# EAGLE design MainBoard (EAGLE 9.6.2)
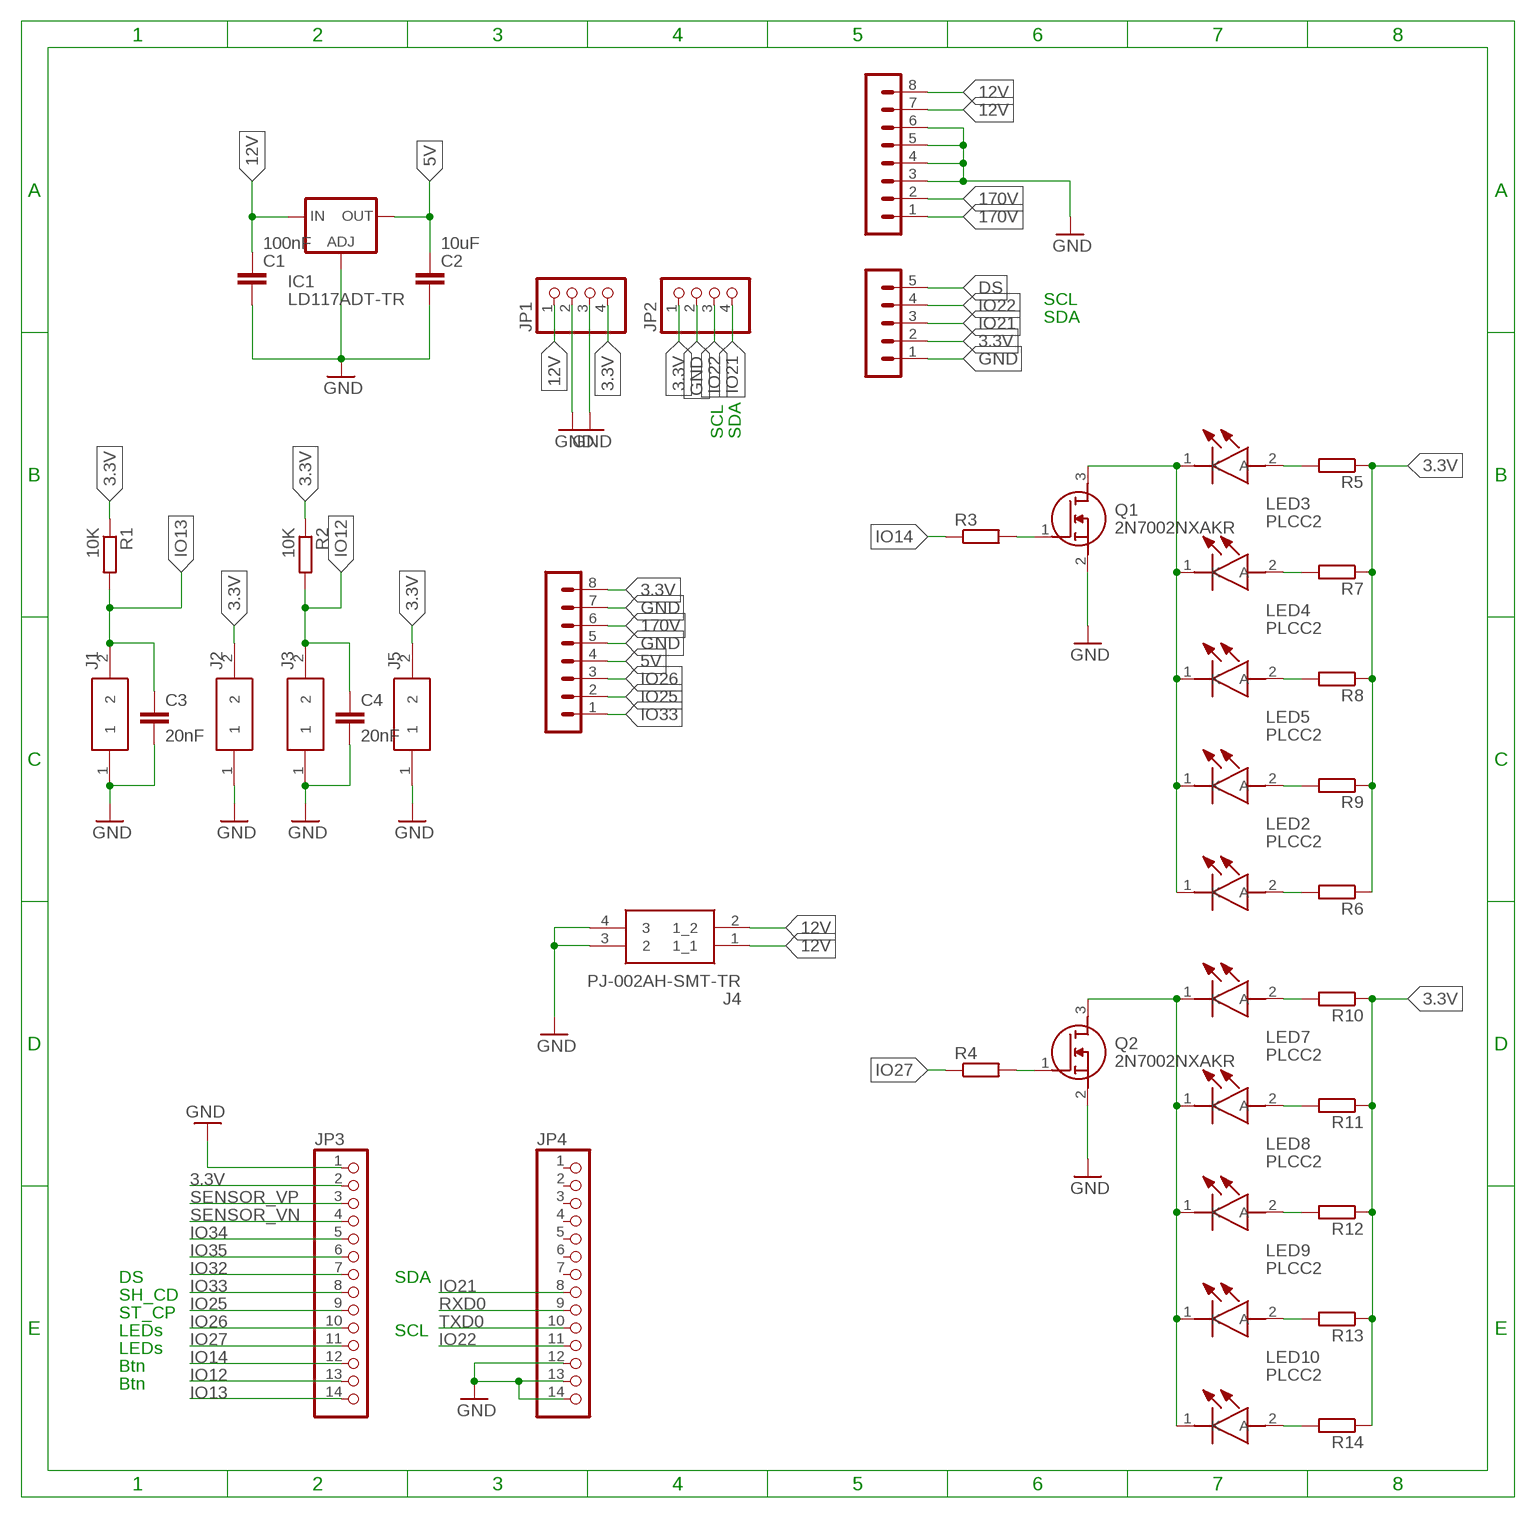
[diagram p0: schematic, sheet 1]

## Parts
C1  100nF  C-EU_1206C1206  [C1206]
C2  10uF  C-EU_1206C1206  [C1206]
C3  20nF  C-EU_805C0805  [C0805]
C4  20nF  C-EU_805C0805  [C0805]
IC1  LD117ADT-TR  [DPACK]
J1  S2B-NSHSS-TB  [SM02B-NSHSS-TB]
J2  S2B-NSHSS-TB  [SM02B-NSHSS-TB]
J3  S2B-NSHSS-TB  [SM02B-NSHSS-TB]
J4  PJ-002AH-SMT-TR  [PJ-002AH-SMT-TR]
J5  S2B-NSHSS-TB  [SM02B-NSHSS-TB]
JP1  PINHD-1X4  [1X04]
JP2  PINHD-1X4  [1X04]
JP3  PINHD-1X14  [1X14]
JP4  PINHD-1X14  [1X14]
LED1  PLCC2  [LEDM3528X200N]
LED2  PLCC2  [LEDM3528X200N]
LED3  PLCC2  [LEDM3528X200N]
LED4  PLCC2  [LEDM3528X200N]
LED5  PLCC2  [LEDM3528X200N]
LED6  PLCC2  [LEDM3528X200N]
LED7  PLCC2  [LEDM3528X200N]
LED8  PLCC2  [LEDM3528X200N]
LED9  PLCC2  [LEDM3528X200N]
LED10  PLCC2  [LEDM3528X200N]
Q1  2N7002NXAKR  [SOT95P230X110-3N]
Q2  2N7002NXAKR  [SOT95P230X110-3N]
R1  10K  R-EU_1206R1206  [R1206]
R2  10K  R-EU_1206R1206  [R1206]
R3  R-EU_1206R1206  [R1206]
R4  R-EU_1206R1206  [R1206]
R5  R-EU_1206R1206  [R1206]
R6  R-EU_1206R1206  [R1206]
R7  R-EU_1206R1206  [R1206]
R8  R-EU_1206R1206  [R1206]
R9  R-EU_1206R1206  [R1206]
R10  R-EU_1206R1206  [R1206]
R11  R-EU_1206R1206  [R1206]
R12  R-EU_1206R1206  [R1206]
R13  R-EU_1206R1206  [R1206]
R14  R-EU_1206R1206  [R1206]
SV1  PINHEADER-1X8  [MA08-1]
SV6  MA05-1  [MA05-1]
SV7  PINHEADER-1X8  [MA08-1]

## Nets
3.3V: J2.2 J5.2 JP1.4 JP2.1 JP3.2 R1.1 R2.1 R5.1 R6.1 R7.1 R8.1 R9.1 R10.1 R11.1 R12.1 R13.1 R14.1 SV1.8 SV6.2
5V: C2.1 IC1.4(OUT) SV1.4
12V: C1.1 IC1.3(IN) J4.1(1_1) J4.2(1_2) JP1.1 SV7.7 SV7.8
170V: SV1.6 SV7.1 SV7.2
DS: SV6.5
GND: C1.2 C2.2 C3.2 C4.2 IC1.1(ADJ) J1.1 J2.1 J3.1 J4.3 J4.4 J5.1 JP1.2 JP1.3 JP2.2 JP3.1 JP4.12 JP4.13 JP4.14 Q1.2(S) Q2.2(S) SV1.5 SV1.7 SV6.1 SV7.3 SV7.4 SV7.5 SV7.6
GND_LED_BTM: LED6.1(K) LED7.1(K) LED8.1(K) LED9.1(K) LED10.1(K) Q2.3(D)
GND_LED_TOP: LED1.1(K) LED2.1(K) LED3.1(K) LED4.1(K) LED5.1(K) Q1.3(D)
IO12: C4.1 J3.2 JP3.13 R2.2
IO13: C3.1 J1.2 JP3.14 R1.2
IO14: JP3.12 R3.1
IO21: JP2.4 JP4.8 SV6.3
IO22: JP2.3 JP4.11 SV6.4
IO25: JP3.9 SV1.2
IO26: JP3.10 SV1.3
IO27: JP3.11 R4.1
IO32: JP3.7
IO33: JP3.8 SV1.1
IO34: JP3.5
IO35: JP3.6
N$2: Q1.1(G) R3.2
N$3: LED1.2(A) R5.2
N$4: LED3.2(A) R7.2
N$5: LED4.2(A) R8.2
N$6: LED5.2(A) R9.2
N$7: LED2.2(A) R6.2
N$8: Q2.1(G) R4.2
N$10: LED6.2(A) R10.2
N$11: LED7.2(A) R11.2
N$12: LED8.2(A) R12.2
N$13: LED9.2(A) R13.2
N$14: LED10.2(A) R14.2
RXD0 [other]: JP4.9
SENSOR_VN: JP3.4
SENSOR_VP: JP3.3
TXD0 [other]: JP4.10
Unconnected: JP4.1 JP4.2 JP4.3 JP4.4 JP4.5 JP4.6 JP4.7

## Notes on the sheet
- SCL
- SDA
- SCL | SDA
- DS | SDA
- SH_CD
- ST_CP
- LEDs | SCL
- LEDs
- Btn
- Btn

## Library data of the parts
C1 C2 = CommonParts:C-EU_1206: CAPACITOR, European symbol; SPICEPREFIX: C
C3 C4 = CommonParts:C-EU_805: CAPACITOR, European symbol; SPICEPREFIX: C
IC1 = nixie_tube:LD117A?*: Low drop fixed and adjustable positive voltage regulators 1 A Source: http://www.st.com/stonline/products/literature/ds/7194/ld1117axx.pdf
J1-J3 J5 = CommonParts:S2B-NSHSS-TB: NSH 1.0mm SMT shrouded R/A PCB header,2P JST NSH Series, 1mm Pitch 2 Way 1 Row Shrouded Right Angle PCB Header, Surface Mount, Solder Termination Source: Datasheet <http://www.jst-mfg.com/product/pdf/eng/eNSH.pdf>; DESCRIPTION: NSH 1.0mm SMT shrouded R/A PCB header,2P JST NSH Series, 1mm Pitch 2 Way 1 Row Shrouded Right Angle PCB Header, Surface Mount, Solder Termination; HEIGHT: mm; MANUFACTURER_NAME: JST (JAPAN SOLDERLESS TERMINALS); MANUFACTURER_PART_NUMBER: SM02B-NSHSS-TB(LF)(SN)
J4 = CommonParts:PJ-002AH-SMT-TR: DC Power Connectors Power Jacks Source: Datasheet <https://componentsearchengine.com/Datasheets/1/PJ-002AH-SMT-TR.pdf>; DESCRIPTION: DC Power Connectors Power Jacks; HEIGHT: mm; MANUFACTURER_NAME: CUI; MANUFACTURER_PART_NUMBER: PJ-002AH-SMT-TR; MOUSER_PART_NUMBER: 490-PJ-002AH-SMT-TR; MOUSER_PRICE-STOCK: https://www.mouser.com/Search/Refine.aspx?Keyword=490-PJ-002AH-SMT-TR
JP1 JP2 = pinhead:PINHD-1X4: PIN HEADER
JP3 JP4 = pinhead:PINHD-1X14: PIN HEADER
LED1-LED10 = CommonParts:PLCC2: Cool White SMT LED, PLCC2 1800mcd Min. Broadcom ASMT-UWB1-NX302, ASMT-UWB Series White LED, 6250K, PLCC 2, Round Lens SMD package Source: Datasheet <https://componentsearchengine.com/Datasheets/1/ASMT-UWB1-NX302.pdf>; DESCRIPTION: Cool White SMT LED, PLCC2 1800mcd Min. Broadcom ASMT-UWB1-NX302, ASMT-UWB Series White LED, 6250K, PLCC 2, Round Lens SMD package; HEIGHT: 2mm; MANUFACTURER_NAME: Avago Technologies; MANUFACTURER_PART_NUMBER: ASMT-UWB1-NX302; MOUSER2_PART_NUMBER: 630-ASMT-UWB1-NX302; MOUSER2_PRICE-STOCK: https://www.mouser.com/Search/Refine.aspx?Keyword=630-ASMT-UWB1-NX302
Q1 Q2 = CommonParts:2N7002NXAKR: NEXPERIA - 2N7002NXAKR - MOSFET Transistor, Trench, N Channel, 190 mA, 60 V, 3 ohm, 10 V, 1.6 V Source: Datasheet <https://componentsearchengine.com/Datasheets/1/2N7002NXAKR.pdf>; DESCRIPTION: NEXPERIA - 2N7002NXAKR - MOSFET Transistor, Trench, N Channel, 190 mA, 60 V, 3 ohm, 10 V, 1.6 V; HEIGHT: 1.1mm; MANUFACTURER_NAME: Nexperia; MANUFACTURER_PART_NUMBER: 2N7002NXAKR; MOUSER_PART_NUMBER: 771-2N7002NXAKR; MOUSER_PRICE-STOCK: https://www.mouser.com/Search/Refine.aspx?Keyword=771-2N7002NXAKR
R1-R14 = CommonParts:R-EU_1206: RESISTOR, European symbol
SV1 SV7 = CommonParts:PINHEADER-1X8: PIN HEADER; OC_FARNELL: unknown; OC_NEWARK: unknown
SV6 = con-lstb:MA05-1: PIN HEADER; OC_FARNELL: unknown; OC_NEWARK: unknown

## Net classes
0 default: width 0.2 mm, drill 0.6 mm, clearance 0.2 mm
1 other: width 0.2 mm, drill 0.2 mm, clearance 0.1 mm

## Board
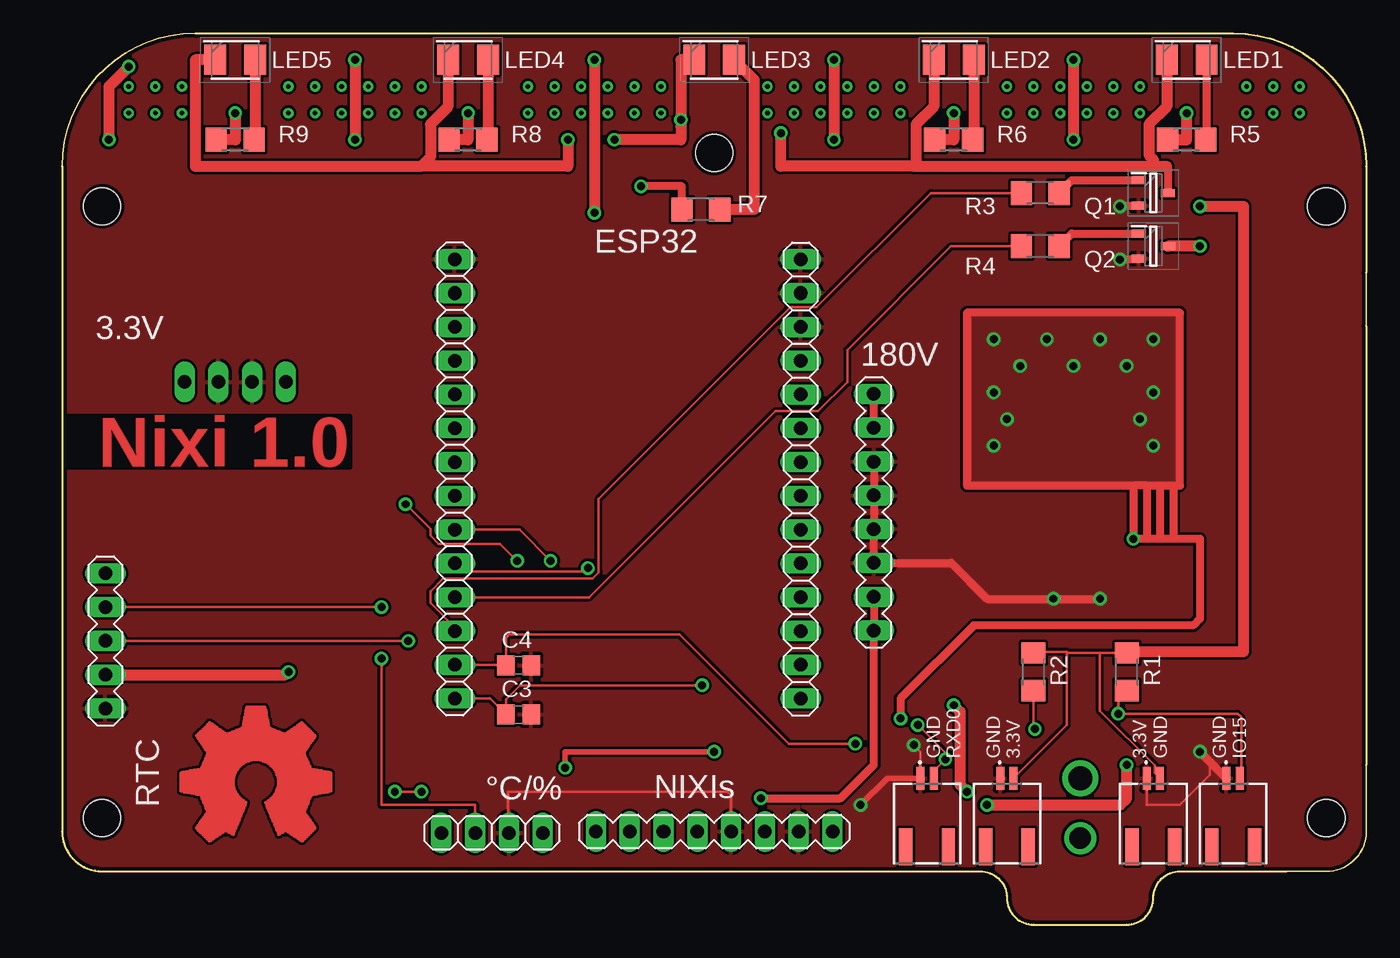
[diagram p1: board, top side]
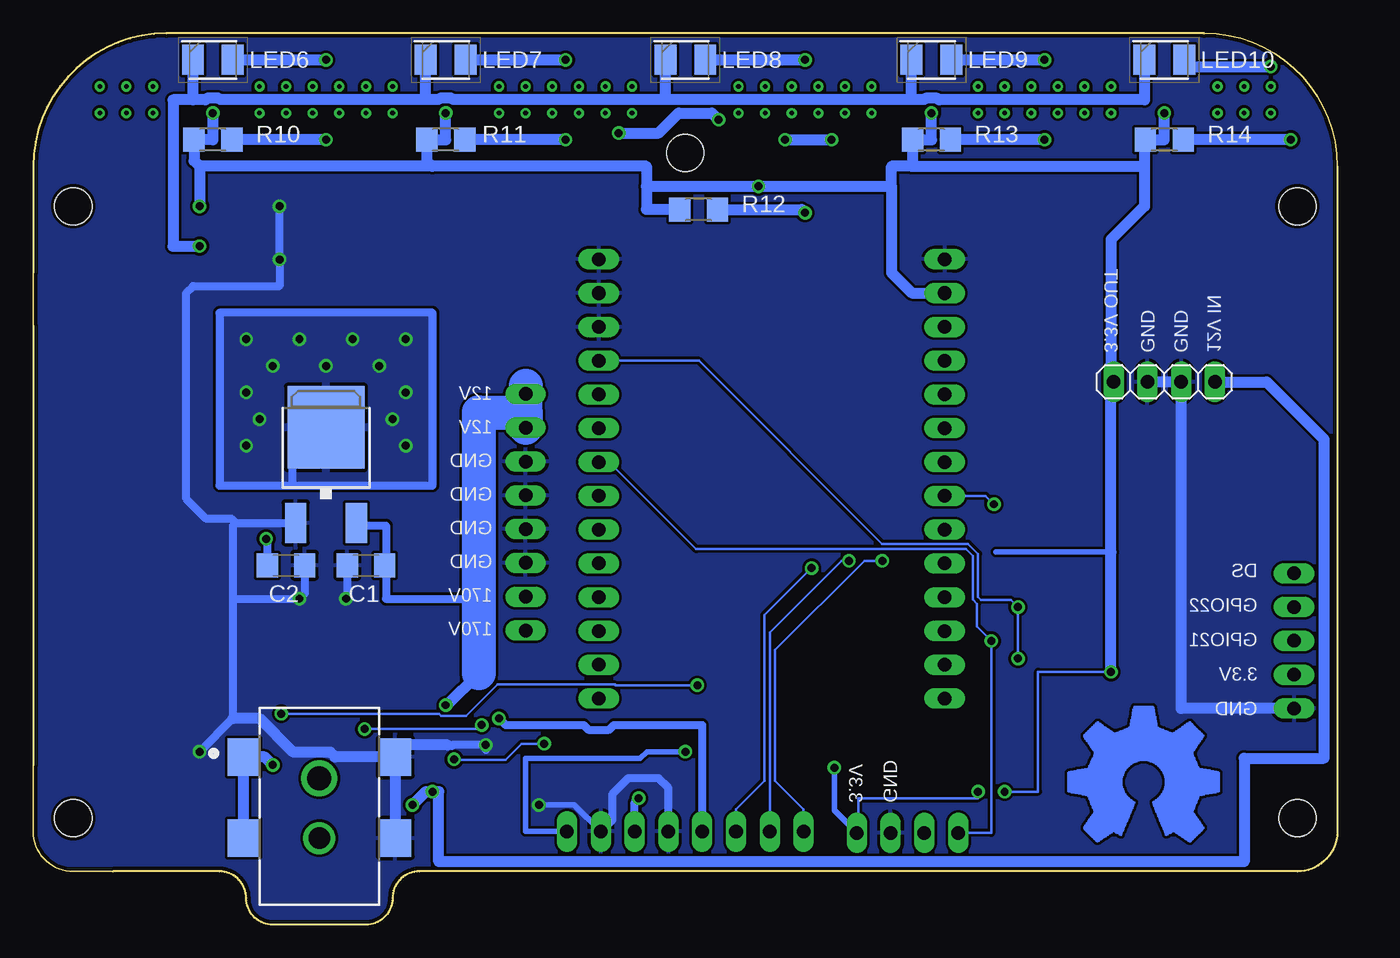
[diagram p2: board, bottom side, seen from below]

Size 98 x 67 mm. Coordinates in mm from the lower left corner, seen from the top.
Outline: 98,45 98,49 98,57 arc90 88,67 10,67 arc90 0,57 0,7 arc90 3,4 69,4 arc-90 71,2 arc90 73,0 80,0 arc90 82,2 arc-90 84,4 92,4 95,4 arc90 98,7 98,45
Outline: 98,45 98,12
Copper layers (1*16): Top 0.035mm / dielectric 1.5mm / Bottom 0.035mm
Design rules "Main_1 *": minimum track width 6mil, minimum drill 0.35mm, track to track 6mil, track to pad 6mil, pad to pad 6mil, via to via 6mil, smd to smd 6mil, copper to edge 10mil, drill to drill 6mil, minimum pad ring 10mil, minimum via ring 8mil, stop-mask expansion 4mil, vias tented up to drill 0mil, thermal gap 10mil
Holes 2.8 mm at 3,54 95,54 3,8 95,8 49,58

### Footprints (pad centres in the part's own frame; a part is rotated, then mirrored left to right if it is on the bottom)
C1206 = smd 1.6 x 1.8: 1 -1.4,0; 2 1.4,0
C0805 = smd 1.3 x 1.5: 1 -0.95,0; 2 0.95,0
DPACK = smd 1.6 x 3: 1 -2.28,-4.8; 3 2.28,-4.8 | smd 5.8 x 6.2: 4 0,2.38
SM02B-NSHSS-TB = smd 0.6 x 1.7: 1 1,0; 2 0,0 | smd 1 x 2.8: 3 -1.1,5.15; 4 2.1,5.15
PJ-002AH-SMT-TR = smd 2.8 x 2.4: 1 11.1,10.2; 2 5,10.2; 3 5,-1.2; 4 11.1,-1.2 | drill 1.8 pad 2.7: 5 9.5,4.5 | drill 1.6 pad 2.4: 6 5,4.5
1X04 = drill 1.016 long: 1 -3.81,0; 2 -1.27,0; 3 1.27,0; 4 3.81,0
1X14 = drill 1.016 long: 1 -16.51,0; 2 -13.97,0; 3 -11.43,0; 4 -8.89,0; 5 -6.35,0; 6 -3.81,0; 7 -1.27,0; 8 1.27,0; 9 3.81,0; 10 6.35,0; 11 8.89,0; 12 11.43,0; 13 13.97,0; 14 16.51,0
LEDM3528X200N = smd 1.65 x 2.25: 1 -1.5,0; 2 1.5,0
SOT95P230X110-3N = smd 1.05 x 0.6: 1 -1.1,0.95; 2 -1.1,-0.95; 3 1.1,0
R1206 = smd 1.6 x 1.803: 1 -1.422,0; 2 1.422,0
MA08-1 = drill 1.016 long: 1 -8.89,0; 2 -6.35,0; 3 -3.81,0; 4 -1.27,0; 5 1.27,0; 6 3.81,0; 7 6.35,0; 8 8.89,0
MA05-1 = drill 1.016 long: 1 -5.08,0; 2 -2.54,0; 3 0,0; 4 2.54,0; 5 5.08,0

### Placement (x,y rotation side)
C1  73,27 180 bottom
C2  79,27 0 bottom
C3  34.3,15.8 0 top
C4  34.3,19.5 0 top
IC1  76,35 0 bottom
J1  88.5,11 180 top
J2  71.5,11 180 top
J3  65.5,11 180 top
J4  72,1.5 90 bottom
J5  82.5,11 180 top
JP1  13,40.8 180 bottom
JP2  32.3,6.9 180 top
JP3  29.5,33.5 270 top
JP4  55.5,33.5 90 top
LED1  84.5,65 0 top
LED2  67,65 0 top
LED3  49,65 0 top
LED4  30.5,65 0 top
LED5  13,65 0 top
LED6  84.5,65 0 bottom
LED7  67,65 0 bottom
LED8  49,65 0 bottom
LED9  30.5,65 0 bottom
LED10  13,65 0 bottom
Q1  82,55 0 top
Q2  82,51 0 top
R1  80,19 270 top
R2  73,19 270 top
R3  73.5,55 0 top
R4  73.5,51 0 top
R5  84.5,59 0 top
R6  67,59 0 top
R7  48,53.75 0 top
R8  30.5,59 0 top
R9  13,59 0 top
R10  84.5,59 0 bottom
R11  67,59 0 bottom
R12  48,53.75 0 bottom
R13  30.5,59 0 bottom
R14  13,59 0 bottom
SV1  49,7 0 top
SV6  3.25,21.33 90 top
SV7  61,31 90 top

### Tracks (layer width: path | path; a pad name or v marks a point on that pad's centre or on a via)
3.3V  (via drill 0.6)
  Top 0.2: J2.2 75.5,15 75.5,20.5 | 75.5,20.5 73.08,20.5 R2.1 | R1.1 78,20.42 | 78,20.42 75.58,20.42 75.5,20.5 | J5.2 82.1,11.4 82.1,11.97 78,16.07 78,20.42 | v27,10 v25,10
  Top 0.406: v49,13 37.8,13 v37.8,11.8
  Top 0.61: R7.1 46.58,55.5 v43.5,55.5
  Top 0.813: v67,61 67,59 R6.1 | v30.5,61 30.5,59 R8.1 | v13,61 13,59 R9.1 | R5.1 84.5,59 v84.5,61 | v85.5,54 88.78,54 88.78,20.5 80.08,20.5 R1.1 | SV6.2 16.79,18.79 v17,19
  Bottom 0.2: v17,19 22.5,19 22.5,10 v25,10 | JP2.1 36,7.01 36,9.5 27,9.5 v27,10
  Bottom 0.406: v49,13 51.89,13 52.38,12.51 61,12.51 61,7 SV1.8 | 25.67,28 17,28 | v37.8,11.8 37.8,8.59 JP2.1
  Bottom 0.813: v67,61 67,59 R11.1 68.42,57.42 68,57 | v30.5,61 30.48,61 30.48,59 R13.1 31.92,57.08 32,57 | v13,61 13,59 R14.1 14.5,58.92 14.5,57 | v84.5,61 84.5,59 R10.1 85.92,57.42 85.5,57 | JP1.4 17,40.99 | 17,40.99 17,51.5 14.5,54 14.5,57 | 32,57 14.5,57 | 32,57 33.5,57 33.5,55.5 | 68,57 51.92,57 51.92,55.5 | 68,57 85.5,57 | 85.5,57 v85.5,54 | R12.1 51.92,53.75 51.92,55.5 | v17,19 17,28 17,40.99 | 51.92,55.5 v43.5,55.5 33.5,55.5 | JP3.2 31.97,47.47 33.5,49 33.5,55.5
5V  (via drill 0.6)
  Top 0.61: 83.5,29 85.5,29 85.5,23 85,22.5 68.5,22.5 63,17 v63,15.5 | 83.5,29 82.5,29 | 82.5,29 81.5,29 | 81.5,33 81.5,29 | 81.5,33 80.5,33 | 80.5,33 v80.5,29 81.5,29 | 80.5,33 68,33 68,46 84,46 84,33 83.5,33 | 81.5,33 82.5,33 | 82.5,33 83.5,33 | 83.5,33 83.5,29 | 82.5,33 82.5,29
  Bottom 0.61: 78.5,33 84,33 84,46 68,46 68,33 78.5,33 | C2.1 80.4,28.9 v80.5,29 | v63,15.5 62.5,15 56.63,15 56.29,14.65 54.71,14.65 54.37,15 47.73,15 SV1.4 | 78.5,33 78.5,36 77.12,37.38 IC1.4
  other vias: 82,36 81,38 82,40 80,42 82,44 78,44 76,42 74,44 72,42 70,44 70,40 71,38 70,36
  pour Bottom: 68,33 84,33 84,46 68,46
  pour Top: 68,46 84,46 84,33 68,33
12V  (via drill 0.6)
  Top 0.61: SV7.7 SV7.8
  Top 0.813: v68,10 67.5,10.5 67.5,16 v67,16.5 | v69.5,9 79.5,9 80,9.5 v80,12
  Bottom 0.61: C1.1 71.5,26.9 | 71.5,26.9 71.5,24.5 65,24.5 64.5,25 | IC1.3 73.52,30 71.5,30 71.5,26.9
  Bottom 0.813: JP1.1 5.3,40.8 1,36.5 1,12.5 7,12.5 7,4.74 67.54,4.74 67.54,10 v68,10 68.5,10 v69.5,9 | v67,16.5 66.9,16.5 64.5,18.9 | v80,12 80.6,12.6 J4.1 J4.2
  Bottom 2.54: 64.5,18.9 64.5,25 64.5,38.5 61,38.5 | 61,40.5 SV7.8 61,38.5 | 61,38.5 SV7.7
170V  (via drill 0.6)
  Top 0.61: v52.5,9.5 58.5,9.5 61,12 SV7.1 SV7.2
  Bottom 0.61: SV1.6 52.81,9.19 v52.5,9.5
GND  (via drill 0.6)
  Top 0.2: J3.1 64.5,13 v64,13.5 | SV1.5 50.27,9.73 50,10 33.5,10 33.5,6.97 JP2.2
  Top 0.203: J5.1 81.5,9 84,9 86.25,11.25 86.25,12.25
  Top 0.406: v60,9 62,11 J3.1
  Top 0.61: J1.1 86.25,12.25 v85.5,13 | SV7.6 SV7.5 SV7.4 SV7.3 66.81,27.19 69.5,24.5 v74.5,24.5 v78,24.5 | v79.5,54 79.55,54.05 Q1.2 | Q2.2 80.85,50 v79.5,50
  Bottom 0.2: 66.5,13.5 66.88,13.5 66.94,13.44
  Bottom 0.406: SV1.7 57.35,9 v60,9
  Bottom 0.61: 64,13.11 v64,13.5 66.5,13.5 66.56,13.44 66.94,13.44 | SV1.5 50.27,10.27 51,11 53.29,11 54.5,9.79 54.5,7.85 SV1.7 | C2.2 77.6,24.9 v78,24.5 83,24.5 | C1.2 74.4,24.6 v74.5,24.5 | 82.8,30.2 IC1.1 | 82.8,30.2 83,30 83,24.5 | 83,24.5 83,15.5 v85.5,13 | 82.8,30.2 83.1,30.5 85,30.5 86.5,32 86.5,47.5 86,48 79.5,48 v79.5,50 v79.5,54
  Bottom 0.813: JP1.3 JP1.2 11.73,16.25 SV6.1 | 66.88,13.5 69.9,13.5 J4.4 | J4.4 J4.3 | J4.4 75.33,12.6 75.69,12.96 78.46,12.96 81,15.5 83,15.5
  pour Top: 0,0 0,57 arc-90 10,67 88,67 arc-90 98,57 98,0
  pour Bottom: 98,0.5 2.5,0.5 arc-90 -0.5,3.5 -0.5,56.5 arc-90 10,67 88,67 arc-90 98,57
GND1  (via drill 0.35)
  other vias: 17,63
GND2  (via drill 0.35)
  other vias: 19,63
GND3  (via drill 0.35)
  other vias: 17,61
GND4  (via drill 0.35)
  other vias: 19,61
GND5  (via drill 0.35)
  other vias: 21,63
GND6  (via drill 0.35)
  other vias: 23,63
GND7  (via drill 0.35)
  other vias: 21,61
GND8  (via drill 0.35)
  other vias: 23,61
GND9  (via drill 0.35)
  other vias: 25,63
GND10  (via drill 0.35)
  other vias: 27,63
GND11  (via drill 0.35)
  other vias: 25,61
GND12  (via drill 0.35)
  other vias: 27,61
GND13  (via drill 0.35)
  other vias: 35,63
GND14  (via drill 0.35)
  other vias: 37,63
GND15  (via drill 0.35)
  other vias: 35,61
GND16  (via drill 0.35)
  other vias: 37,61
GND17  (via drill 0.35)
  other vias: 39,63
GND18  (via drill 0.35)
  other vias: 41,63
GND19  (via drill 0.35)
  other vias: 39,61
GND20  (via drill 0.35)
  other vias: 41,61
GND21  (via drill 0.35)
  other vias: 43,63
GND22  (via drill 0.35)
  other vias: 45,63
GND23  (via drill 0.35)
  other vias: 43,61
GND24  (via drill 0.35)
  other vias: 45,61
GND25  (via drill 0.35)
  other vias: 53,63
GND26  (via drill 0.35)
  other vias: 55,63
GND27  (via drill 0.35)
  other vias: 53,61
GND28  (via drill 0.35)
  other vias: 55,61
GND29  (via drill 0.35)
  other vias: 57,63
GND30  (via drill 0.35)
  other vias: 59,63
GND31  (via drill 0.35)
  other vias: 57,61
GND32  (via drill 0.35)
  other vias: 59,61
GND33  (via drill 0.35)
  other vias: 61,63
GND34  (via drill 0.35)
  other vias: 63,63
GND35  (via drill 0.35)
  other vias: 61,61
GND36  (via drill 0.35)
  other vias: 63,61
GND37  (via drill 0.35)
  other vias: 71,63
GND38  (via drill 0.35)
  other vias: 73,63
GND39  (via drill 0.35)
  other vias: 71,61
GND40  (via drill 0.35)
  other vias: 73,61
GND41  (via drill 0.35)
  other vias: 75,63
GND42  (via drill 0.35)
  other vias: 77,63
GND43  (via drill 0.35)
  other vias: 75,61
GND44  (via drill 0.35)
  other vias: 77,61
GND45  (via drill 0.35)
  other vias: 79,63
GND46  (via drill 0.35)
  other vias: 81,63
GND47  (via drill 0.35)
  other vias: 79,61
GND48  (via drill 0.35)
  other vias: 81,61
GND49  (via drill 0.35)
  other vias: 5,63
GND50  (via drill 0.35)
  other vias: 7,63
GND51  (via drill 0.35)
  other vias: 9,63
GND52  (via drill 0.35)
  other vias: 5,61
GND53  (via drill 0.35)
  other vias: 7,61
GND54  (via drill 0.35)
  other vias: 9,61
GND55  (via drill 0.35)
  other vias: 89,63
GND56  (via drill 0.35)
  other vias: 91,63
GND57  (via drill 0.35)
  other vias: 93,63
GND58  (via drill 0.35)
  other vias: 89,61
GND59  (via drill 0.35)
  other vias: 91,61
GND60  (via drill 0.35)
  other vias: 93,61
GND_LED_BTM  (via drill 0.6)
  Top 0.813: v85.5,51 Q2.3
  Bottom 0.813: LED10.1 14.5,62 29.93,62 30.04,62.11 30.96,62.11 31.05,62.02 32,62.02 | 32,62.02 50.5,62.02 | 86,62 85.07,62 84.96,62.11 84.04,62.11 83.95,62.02 68.5,62.02 | 86,62 87.5,62 87.5,51 v85.5,51 | 50.5,62.02 66.45,62.02 66.54,62.11 67.46,62.11 67.55,62.02 68.5,62.02 | 32,62.02 LED9.1 | 50.5,62.02 LED8.1 | 68.5,62.02 LED7.1 | 86,62 LED6.1
GND_LED_TOP  (via drill 0.6)
  Top 0.61: 83,57 83.1,56.9 Q1.3
  Top 0.813: LED5.1 10,65 10,57 27,57 | 64,57 82,57 | 82,57 83,57 | LED2.1 65.5,61.48 64.17,60.15 64.17,57.17 64,57 | LED3.1 46.52,65 46.5,64.98 v46.5,60.5 46.5,60 46.5,59 v41.5,59 | LED1.1 83,61.48 81.67,60.15 81.67,57.85 82,57.52 82,57 | LED4.1 29,61.48 27.67,60.15 27.67,57.67 27,57 | v38,59 38,57 27,57 | 64,57 54,57 v54,59.5
  Bottom 0.813: v41.5,59 v38,59 | v54,59.5 51,59.5 49.5,61 47,61 v46.5,60.5
IO12  (via drill 0.6)
  Top 0.2: v66.38,12.43 66.38,12.92 v64.3,15 | v73.1,14.7 73,14.8 R2.2
  Top 0.203: JP3.13 33.32,19.53 C4.1 33.35,21.55 33.6,21.8 46.4,21.8 54.6,13.6 v59.6,13.6 | v66.38,12.43 65.5,11.55 J3.2
  Bottom 0.2: v64.3,15 64.6,14.7 v73.1,14.7
  Bottom 0.203: v59.6,13.6 61.3,13.6 62.5,12.4 66.35,12.4 v66.38,12.43
IO13  (via drill 0.6)
  Top 0.2: v79.36,15.86 88.34,15.86 88.6,15.6 88.6,11.1 J1.2
  Top 0.203: JP3.14 32.16,16.99 C3.1 33.35,16.95 34.4,18 v48.1,18 | v79.36,15.86 79.36,16.93 R1.2
  Bottom 0.203: v48.1,18 54.24,18 54.3,18.05 63.12,18.05 65.48,15.7 67.33,15.7 67.49,15.86 v79.36,15.86
IO14
  Top 0.2: R3.1 65.29,55 56.7,46.41 54.71,46.41 40.31,32 40.31,26.47 39.84,26 28.63,26 27.68,25.05 27.68,24.17 29.5,22.35 JP3.12
IO21  (via drill 0.6)
  Top 0.2: SV6.3 v26,21.33
  Bottom 0.2: 26,21.5 v26,21.33 26,6.9 JP2.4
  Bottom 0.203: v26,21.33 27.08,22.41 27.08,24.12 27.4,24.45 27.4,27.7 27.93,28.22 48.19,28.22 54.74,34.77 JP4.8
IO22  (via drill 0.6)
  Top 0.2: SV6.4 v24,23.87 | v24,20 24,9 31.03,9 JP2.3
  Bottom 0.2: 24,24 v24,23.87 v24,20
  Bottom 0.203: v24,23.87 24.54,24.41 26.79,24.41 27,24.61 27,27.87 27.76,28.63 34.22,28.63 47.99,42.39 JP4.11
IO25  (via drill 0.6)
  Top 0.2: v36.7,27.35 34.36,29.69 JP3.9
  Bottom 0.2: SV1.2 42.65,21.96 37.25,27.35 v36.7,27.35
IO26  (via drill 0.6)
  Top 0.2: v39.51,26.81 39.25,26.55 30.1,26.55 JP3.10
  Bottom 0.2: SV1.3 45.19,8.66 43.05,10.8 43.05,23.26 v39.51,26.81
IO27
  Top 0.2: JP3.11 39.61,24.61 53.6,38.6 56.8,38.6 59,40.8 59,43.2 66.8,51 R4.1
IO33  (via drill 0.6)
  Top 0.2: v34.2,27.35 32.92,28.63 28.3,28.63 27.68,29.25 27.68,29.72 v25.8,31.6
  Bottom 0.2: SV1.1 40.11,8.66 42.25,10.8 42.25,20.65 35.55,27.35 v34.2,27.35 | v25.8,31.6 26.43,32.23 JP3.8
N$2
  Top 0.61: R3.2 75.87,55.95 Q1.1
N$3
  Top 0.61: LED1.2 86,59.08
  Top 0.813: 86,59.08 R5.2
N$4
  Top 0.813: LED3.2 52,63.5 52,53.75 R7.2
N$5
  Top 0.813: LED4.2 32,59.08 R8.2
N$6
  Top 0.813: LED5.2 14.5,59.08 R9.2
N$7
  Top 0.813: LED2.2 68.5,59.08 R6.2
N$8
  Top 0.61: R4.2 75.87,51.95 Q2.1
N$10  (via drill 0.6)
  Top 0.813: v76,65 v76,59
  Bottom 0.813: LED6.2 v76,65 | v76,59 R10.2
N$11  (via drill 0.6)
  Top 0.813: v58,65 v58,59
  Bottom 0.813: LED7.2 v58,65 | v58,59 R11.2
N$12  (via drill 0.6)
  Top 0.813: v40,65 v40,53.5
  Bottom 0.813: LED8.2 v40,65 | R12.2 40.25,53.75 v40,53.5
N$13  (via drill 0.6)
  Top 0.813: v22,65 v22,59
  Bottom 0.813: LED9.2 v22,65 | v22,59 R13.2
N$14  (via drill 0.6)
  Top 0.813: v5,64.5 3.5,63 v3.5,59
  Bottom 0.813: LED10.2 11,64.5 v5,64.5 | v3.5,59 R14.2
(copper drawn outside any net)
  shapes: Bottom area x369, Top area x370

### Text on the board
Top: Nixi 1.0
tNames: ESP32 | 3.3V | 180V | RTC | GND | RXD0 | GND | 3.3V | 3.3V | GND | GND | IO15 | NIXIs | °C/%
bNames: 12V IN | GND | GND | 3.3V OUT | 12V | 12V | GND | GND | GND | GND | DS | GPIO22 | 170V | 170V | GPIO21 | 3.3V | GND | GND | 3.3V
tStop: Nixi 1.0